# EasyEDA Pro project V2.0.epro, board 正式版
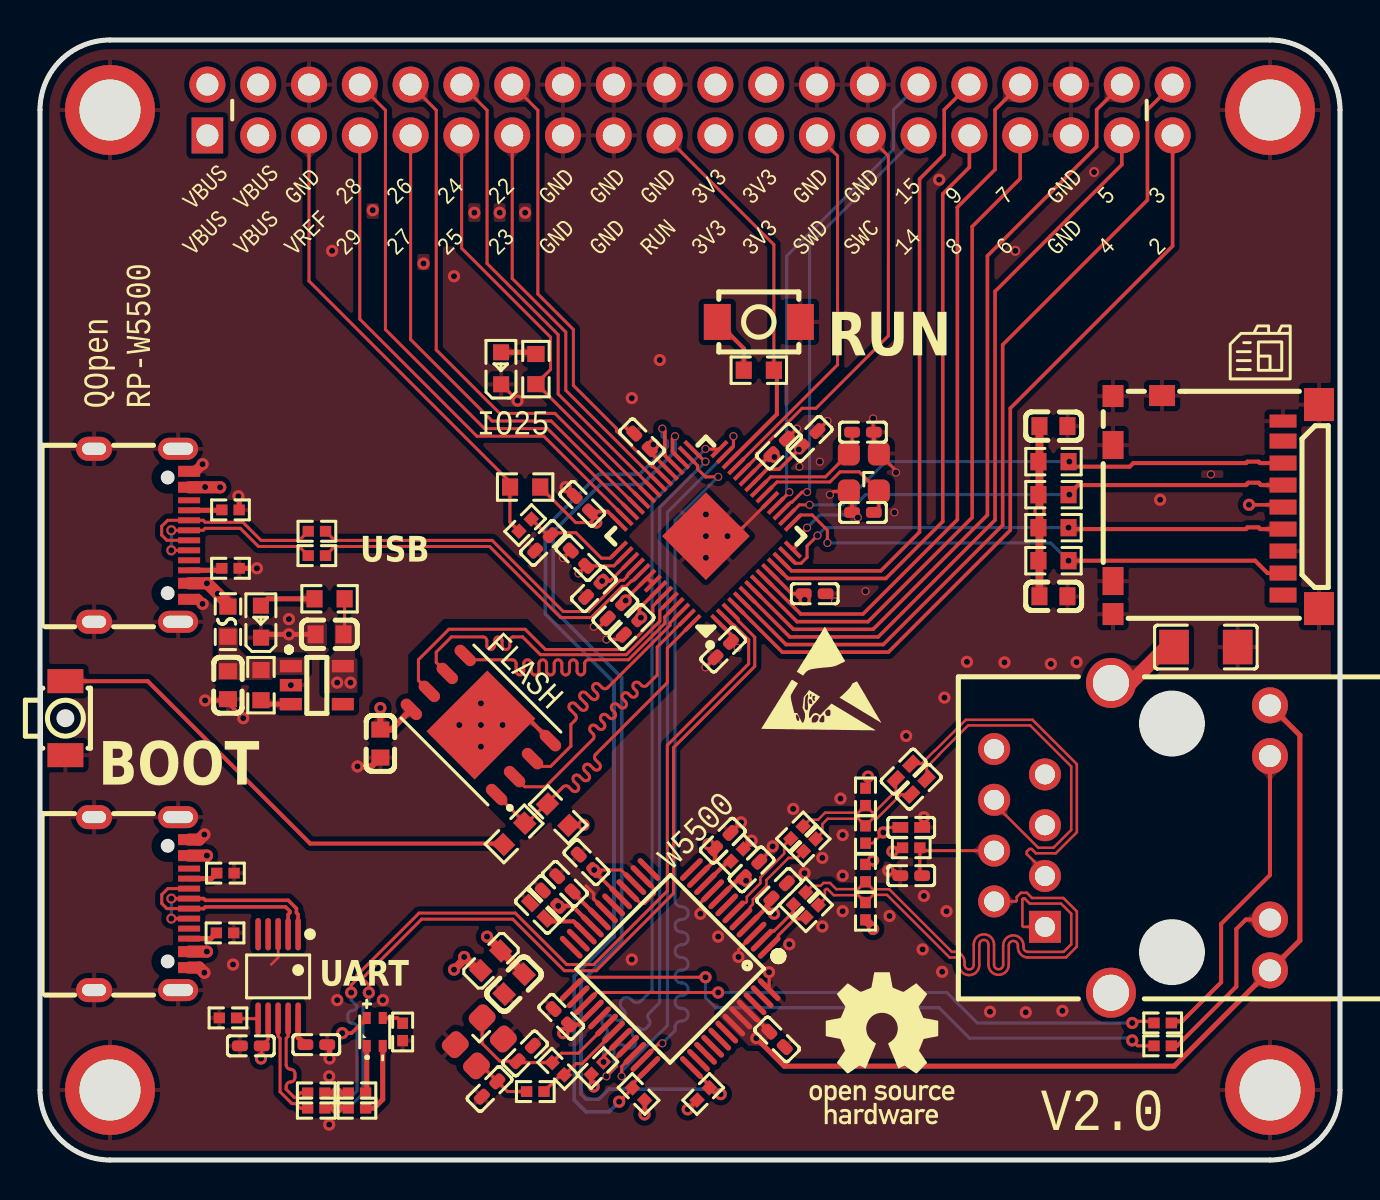
[diagram p1: board, top side]
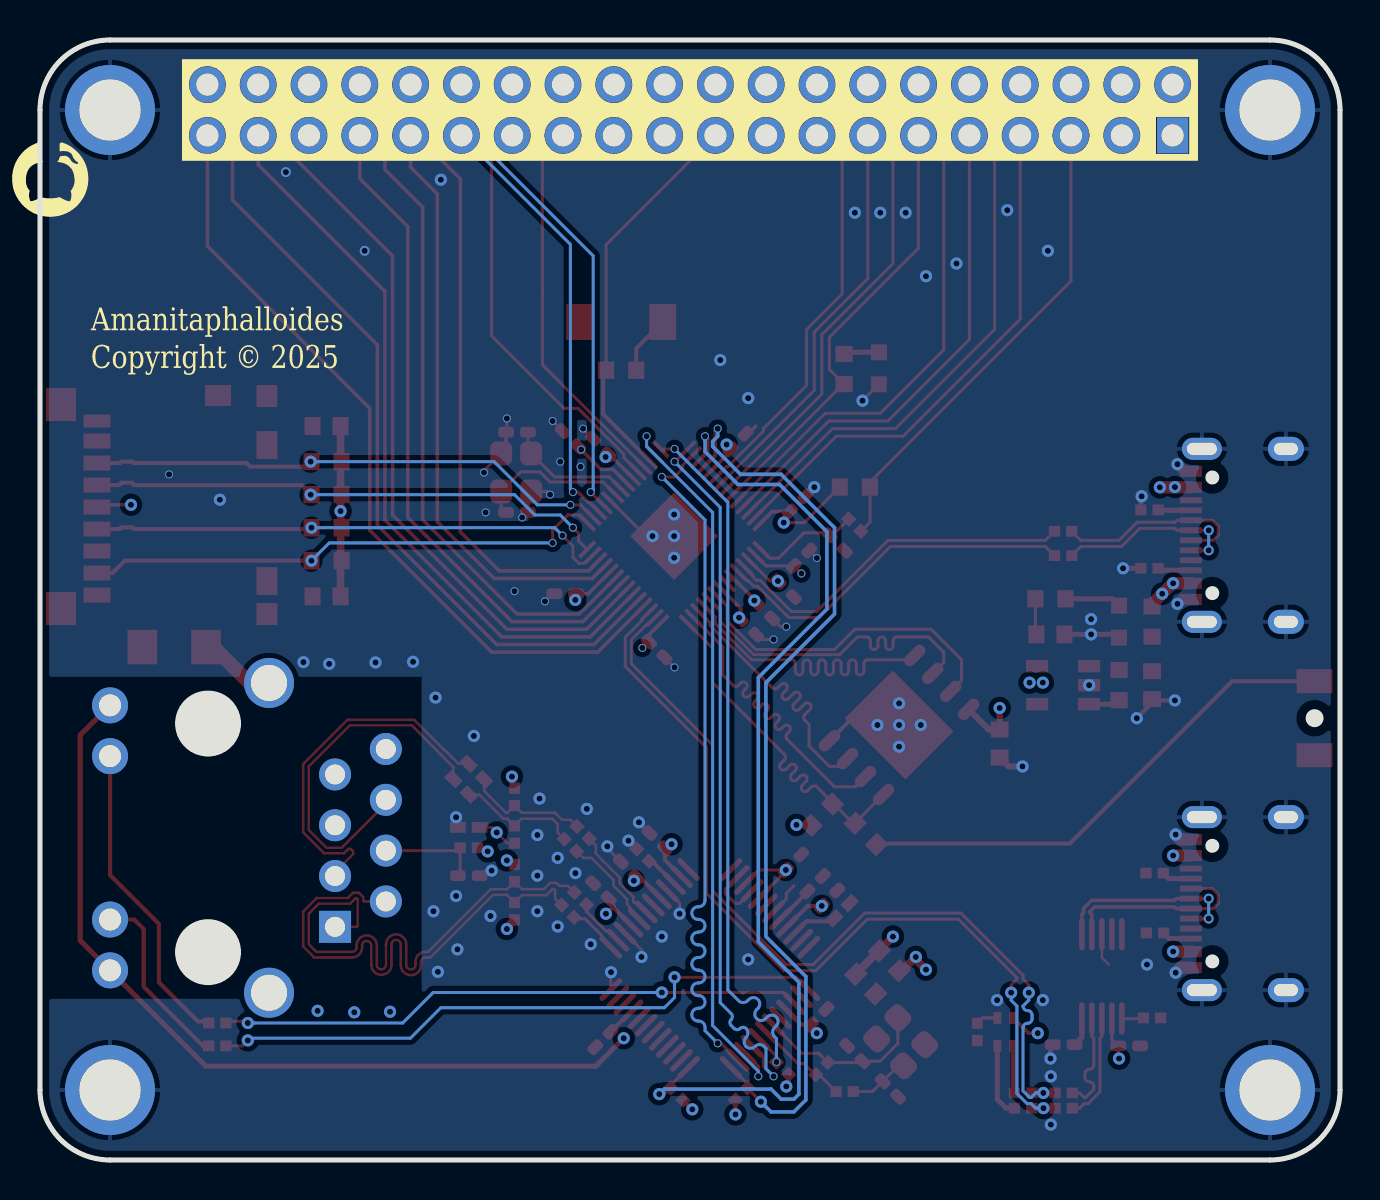
[diagram p2: board, bottom side, seen from below]

Outline 65 x 56 mm; copper layers: Top Layer, Inner1, Inner2, Bottom Layer. Coordinates in mm from the lower left corner of the outline.
Outline path: 0,52.5 0,3.5 arc(1.03,1.03) 3.5,0 61.5,0 arc(63.97,1.03) 65,3.5 65,52.5 arc(63.97,54.97) 61.5,56 3.5,56 arc(1.03,54.97) 0,52.5
Stack: Top Layer 0.035mm 外层铜厚1oz / Dielectric1 0.2104mm 7628 RC49% 8.6mil / Inner1 0.0152mm 内层铜厚 / Dielectric2 1.065mm 1.1mm H/HOZ 含铜 / Inner2 0.0152mm 内层铜厚 / Dielectric3 0.2104mm 7628 RC49% 8.6mil / Bottom Layer 0.035mm 外层铜厚1oz

## Design rules (mm)
net D-: DP12
net D+: DP12
net USB-: DP6
net USB+: DP6
net GPIO0: DP8
net GPIO1: DP8
net $1N8173: DP2
net $1N8174: DP2
net D+2: DP13
net D-2: DP13
net TXP: DP5
net TXN: DP5
net RXP: DP3
net RXN: DP3
net $1N16357: DP9
net $1N16354: DP9
net $1N70953: DP10
net $1N70956: DP10
net $1N70865: DP11
net $1N70868: DP11
template: 自定义配置
spacing copperThickness1oz (default): track to track 0.102, other pairs 0.152 to 0.3
spacing copperThickness2oz: track to track 0.203, other pairs 0.152 to 0.3
track width copperThickness1oz (default): min 0.127, default 0.152, max 2.54
track width copperThickness2oz: min 0.203, default 0.254, max 2.54
differential pair differentialPair (default): width min 0.127, default 0.152, max 2.54; gap min 0.152, default 0.152
via viaSize (default): diameter min 0.4, default 0.61, max 10; hole min 0.3, default 0.305, max 6.299

## Placement (name value [footprint] x y rotation side)
C1  10uF  [C0603]  50.67 36.7 180 top
C2  100nF  [C0603]  50.67 28.19 180 top
C3  1uF  [C0603]  9.4 23.74 90 top
C4  1uF  [C0603]  14.48 26.28 0 top
C5  100nF  [C0402#2]  13.81 5.77 0 top
C6  10nF  [C0402]  43.56 16.63 180 top
C7  6.8nF  [C0402]  43.94 18.66 45 top
C8  6.8nF  [C0402]  43.18 19.42 45 top
C9  100nF  [C0402#2]  10.54 5.71 0 top
C10  22nF  [C0402#2]  43.56 14.22 0 top
C11  4.7uF  [C0402#2]  38.74 28.31 0 top
C12  4.7uF  [C0402#2]  29.58 26.65 225 top
C13  100nF  [C0402#2]  36.85 6.03 135 top
C14  1uF  [C0603]  23.71 8.8 45 top
C15  100nF  [C0402#2]  34.14 15.97 225 top
C16  100nF  [C0402#2]  27.32 14.89 315 top
C17  100nF  [C0402#2]  36.96 13.45 225 top
C18  100nF  [C0402#2]  35.58 14.53 225 top
C19  100nF  [C0402#2]  25.53 13.09 315 top
C20  100nF  [C0402#2]  26.92 30.09 135 top
C21  100nF  [C0402#2]  34.16 25.52 225 top
C22  100nF  [C0402#2]  30.1 35.93 135 top
C23  100nF  [C0402#2]  27.12 32.81 135 top
C24  100nF  [C0402#2]  28.77 27.46 225 top
C25  100nF  [C0402#2]  38.48 36.06 45 top
C26  1nF  [C1206]  58.29 25.65 180 top
C27  100nF  [C0402#2]  27.69 28.54 225 top
C28  100nF  [C0402#2]  36.96 35.68 45 top
C29  4.7uF  [C0402#2]  25.15 30.85 45 top
C30  100nF  [C0402#2]  26.06 7.16 135 top
C31  12pF  [C0402#2]  41.15 32.38 0 top
C32  12pF  [C0402#2]  41.15 36.39 180 top
C33  10pF  [C0402#2]  22.48 3.55 45 top
C34  4.7uF  [C0402#2]  26.24 13.81 315 top
C35  10pF  [C0402#2]  24.26 5.33 225 top
C36  10nF  [C0402]  24.9 12.46 315 top
C37  100nF  [C0603]  17.02 20.82 270 top
CARD1  TF-020  [TF-SMD_TF-020]  58.8 32.76 90 top
F1  BSMD0603-050-6V  [F0603]  9.4 26.92 270 top
H1  B-2100S40P-B110  [HDR-TH_40P-P2.54-V-M-R2-C20-S2.54]  32.5 52.5 0 top
J1  HR911105A  [RJ45-TH_HR911105A]  54.6 16.11 90 top
L1  BLM18PG121SN1D  [L0603]  22.54 9.96 225 top
LED1  NCD0603R1  [LED0603-RD_RED]  11.05 26.92 90 top
LED2  NH-B1515RGBA-HF  [LED-ARRAY-SMD_4P-L1.6-W1.5-TL_NH-B1515RGBA]  16.74 6.4 90 top
LED3  NCD0603R1  [LED0603-RD_RED]  23.05 39.59 90 top
NOREF  -  [Pad_e558]  3.5 52.5 0 top
NOREF#2  -  [Pad_e559]  61.5 52.5 0 top
NOREF#3  -  [Pad_e560]  61.5 3.5 0 top
NOREF#4  -  [Pad_e553]  3.5 3.5 0 top
R1  27Ω  [R0402]  13.84 31.44 0 top
R2  27Ω  [R0402]  13.84 30.22 0 top
R3  5.1kΩ  [R0402]  9.53 32.5 180 top
R4  470Ω  [R0603]  14.48 28.06 0 top
R5  10kΩ  [R0603]  50.67 34.92 0 top
R6  10kΩ  [R0603]  50.67 33.27 0 top
R7  10kΩ  [R0603]  50.67 31.62 0 top
R8  5.1kΩ  [R0402]  9.53 29.58 180 top
R9  100kΩ  [R0603]  11.05 23.74 90 top
R10  10kΩ  [R0603]  50.67 29.97 0 top
R11  1kΩ  [R0402]  18.13 6.4 270 top
R12  5.1kΩ  [R0402]  9.27 14.34 180 top
R13  100Ω  [R0402]  15.85 3.35 0 top
R14  100Ω  [R0402]  15.85 2.59 0 top
R15  22Ω  [R0402]  13.81 3.35 0 top
R16  22Ω  [R0402]  13.81 2.59 0 top
R17  5.1kΩ  [R0402]  9.25 11.36 180 top
R18  4.7kΩ  [R0402]  9.4 7.1 0 top
R19  10Ω  [R0402]  43.56 15.61 0 top
R20  200Ω  [R0603]  24.26 33.65 0 top
R21  100Ω  [R0402]  56.13 5.71 0 top
R22  100Ω  [R0402]  56.13 6.85 0 top
R23  1Ω  [R0402]  24.26 31.74 225 top
R24  4.7kΩ  [R0402]  33.16 3.3 225 top
R25  49.9Ω  [R0402]  41.28 14.34 90 top
R26  49.9Ω  [R0402]  41.28 12.44 270 top
R27  4.7kΩ  [R0402]  29.93 3.3 315 top
R28  4.7kΩ  [R0402]  27.87 4.59 225 top
R29  49.9Ω  [R0402]  41.28 18.15 90 top
R30  49.9Ω  [R0402]  41.28 16.27 270 top
R31  3.3Ω  [R0402]  38.61 12.44 225 top
R32  3.3Ω  [R0402]  37.97 13.07 45 top
R33  3.3Ω  [R0402]  38.48 15.74 225 top
R34  3.3Ω  [R0402]  37.85 16.38 45 top
R35  470Ω  [R0603]  24.8 39.55 90 top
R36  12.4kΩ  [R0402]  34.86 15.25 225 top
R37  1MΩ  [R0402]  25.91 4.56 315 top
R38  0Ω  [R0402]  24.76 3.42 0 top
R39  1kΩ  [R0603]  35.94 39.49 180 top
R40  10kΩ  [R0603]  25.91 17.27 315 top
R41  1kΩ  [R0603]  23.71 16.31 225 top
RUN  TS-1071AD-A1B3-D4  [SW-SMD_L4.0-W3.0-LS4.8]  35.94 41.9 0 top
SW1  TS-1063S-B3D4  [KEY-SMD_L3.0-W2.5-LS4.0_TS-1603S]  1.27 22.09 270 top
U1  AP2112K-3.3TRG1  [SOT-25-5_L2.9-W1.6-P0.95-LS2.8-BL]  13.84 23.74 270 top
U2  CH340E  [MSOP-10_L3.0-W3.0-P0.50-LS5.0-BL]  11.91 9.18 180 top
U3  RP2040  [LQFN-56_L7.0-W7.0-P0.4-EP]  33.29 31.19 135 top
U4  W5500  [LQFP-48_L7.0-W7.0-P0.50-LS9.0-BL]  31.51 9.58 135 top
U5  W25Q16  [WSON-8_L6.0-W5.0-P1.27-BL-EP]  22.05 21.75 45 top
USB1  TYPE-C 16PIN 2MD(073)  [USB-C-SMD_TYPE-C-6PIN-2MD-073]  5.08 31.23 270 top
USB2  TYPE-C 16PIN 2MD(073)  [USB-C-SMD_TYPE-C-6PIN-2MD-073]  5.08 12.82 270 top
X1  12MHz  [osc-smd_4p-l2.5-w2.0-bl]  41.19 34.38 90 top
X2  25MHz  [CRYSTAL-SMD_4P-L2.5-W2.0-BL]  21.97 5.91 225 top

## Footprints (pads in the part's own frame, mm; a bottom-side part is the same pattern mirrored in y, then rotated)
C0402
  rect 0.79x0.54 smd: 1(-0.545,0) 2(0.545,0)
C0402#2
  rrect 0.79x0.54 smd: 1(-0.545,0) 2(0.545,0)
C0603
  rect 0.8x0.9 smd: 1(-0.7,0) 2(0.7,0)
C1206
  rect 1.485x1.728 smd: 1(-1.593,0) 2(1.593,0)
CRYSTAL-SMD_4P-L2.5-W2.0-BL
  rrect 1.2x1.1 smd: 1(-0.95,-0.75) 2(0.95,-0.75) 3(0.95,0.75) 4(-0.95,0.75)
F0603
  rect 0.806x0.864 smd: 1(-0.753,0) 2(0.753,0)
HDR-TH_40P-P2.54-V-M-R2-C20-S2.54
  rect 1.575x1.8 hole 1.1: 1(-24.13,-1.27)
  round 1.8 hole 1.1: 2(-24.13,1.27) 3(-21.59,-1.27) 4(-21.59,1.27) 5(-19.05,-1.27) 6(-19.05,1.27) 7(-16.51,-1.27) 8(-16.51,1.27) 9(-13.97,-1.27) 10(-13.97,1.27) 11(-11.43,-1.27) 12(-11.43,1.27) 13(-8.89,-1.27) 14(-8.89,1.27) 15(-6.35,-1.27) 16(-6.35,1.27) 17(-3.81,-1.27) 18(-3.81,1.27) 19(-1.27,-1.27) 20(-1.27,1.27) 21(1.27,-1.27) 22(1.27,1.27) 23(3.81,-1.27) 24(3.81,1.27) 25(6.35,-1.27) 26(6.35,1.27) 27(8.89,-1.27) 28(8.89,1.27) 29(11.43,-1.27) 30(11.43,1.27) 31(13.97,-1.27) 32(13.97,1.27) 33(16.51,-1.27) 34(16.51,1.27) 35(19.05,-1.27) 36(19.05,1.27) 37(21.59,-1.27) 38(21.59,1.27) 39(24.13,-1.27) 40(24.13,1.27)
KEY-SMD_L3.0-W2.5-LS4.0_TS-1603S
  rect 1.2x1.8 smd: 1(-1.85,0) 2(1.85,0)
L0603
  rect 0.8x0.864 smd: 1(-0.7,0) 2(0.7,0)
LED0603-RD_RED
  rect 0.8x0.8 smd: 1(-0.799,-0.004) 2(0.799,0.004)
LED-ARRAY-SMD_4P-L1.6-W1.5-TL_NH-B1515RGBA
  rect 0.6x0.4 smd: 1(-0.7,0.4) 2(0.7,0.4) 3(0.7,-0.4) 4(-0.7,-0.4)
LQFN-56_L7.0-W7.0-P0.4-EP
  rect 1.1x0.2 smd: 1(-3.55,2.6) 2(-3.55,2.2) 3(-3.55,1.8) 4(-3.55,1.4) 5(-3.55,1) 6(-3.55,0.6) 7(-3.55,0.2) 8(-3.55,-0.2) 9(-3.55,-0.6) 10(-3.55,-1) 11(-3.55,-1.4) 12(-3.55,-1.8) 13(-3.55,-2.2) 14(-3.55,-2.6) 29(3.55,-2.6) 30(3.55,-2.2) 31(3.55,-1.8) 32(3.55,-1.4) 33(3.55,-1) 34(3.55,-0.6) 35(3.55,-0.2) 36(3.55,0.2) 37(3.55,0.6) 38(3.55,1) 39(3.55,1.4) 40(3.55,1.8) 41(3.55,2.2) 42(3.55,2.6)
  rect 0.2x1.1 smd: 15(-2.6,-3.55) 16(-2.2,-3.55) 17(-1.8,-3.55) 18(-1.4,-3.55) 19(-1,-3.55) 20(-0.6,-3.55) 21(-0.2,-3.55) 22(0.2,-3.55) 23(0.6,-3.55) 24(1,-3.55) 25(1.4,-3.55) 26(1.8,-3.55) 27(2.2,-3.55) 28(2.6,-3.55) 43(2.6,3.55) 44(2.2,3.55) 45(1.8,3.55) 46(1.4,3.55) 47(1,3.55) 48(0.6,3.55) 49(0.2,3.55) 50(-0.2,3.55) 51(-0.6,3.55) 52(-1,3.55) 53(-1.4,3.55) 54(-1.8,3.55) 55(-2.2,3.55) 56(-2.6,3.55)
  rect 3.1x3.1 smd: 57(0,0)
LQFP-48_L7.0-W7.0-P0.50-LS9.0-BL
  oval 0.27x1.5 smd: 1(-2.75,-4.25) 2(-2.25,-4.25) 3(-1.75,-4.25) 4(-1.25,-4.25) 5(-0.75,-4.25) 6(-0.25,-4.25) 7(0.25,-4.25) 8(0.75,-4.25) 9(1.25,-4.25) 10(1.75,-4.25) 11(2.25,-4.25) 12(2.75,-4.25) 25(2.75,4.25) 26(2.25,4.25) 27(1.75,4.25) 28(1.25,4.25) 29(0.75,4.25) 30(0.25,4.25) 31(-0.25,4.25) 32(-0.75,4.25) 33(-1.25,4.25) 34(-1.75,4.25) 35(-2.25,4.25) 36(-2.75,4.25)
  oval 1.5x0.27 smd: 13(4.25,-2.75) 14(4.25,-2.25) 15(4.25,-1.75) 16(4.25,-1.25) 17(4.25,-0.75) 18(4.25,-0.25) 19(4.25,0.25) 20(4.25,0.75) 21(4.25,1.25) 22(4.25,1.75) 23(4.25,2.25) 24(4.25,2.75) 37(-4.25,2.75) 38(-4.25,2.25) 39(-4.25,1.75) 40(-4.25,1.25) 41(-4.25,0.75) 42(-4.25,0.25) 43(-4.25,-0.25) 44(-4.25,-0.75) 45(-4.25,-1.25) 46(-4.25,-1.75) 47(-4.25,-2.25) 48(-4.25,-2.75)
MSOP-10_L3.0-W3.0-P0.50-LS5.0-BL
  oval 0.28x1.62 smd: 1(-1,-2.11) 2(-0.5,-2.11) 3(0,-2.11) 4(0.5,-2.11) 5(1,-2.11) 6(1,2.11) 7(0.5,2.11) 8(0,2.11) 9(-0.5,2.11) 10(-1,2.11)
osc-smd_4p-l2.5-w2.0-bl
  rrect 1.2x1.1 smd: 1(-0.95,-0.75) 2(0.95,-0.75) 3(0.95,0.75) 4(-0.95,0.75)
Pad_e553
  round 4.5 hole 3.05: 1(0,0)
Pad_e558
  round 4.5 hole 3.05: 1(0,0)
Pad_e559
  round 4.5 hole 3.05: 2(0,0)
Pad_e560
  round 4.5 hole 3.05: 3(0,0)
R0402
  rect 0.566x0.54 smd: 1(-0.433,0) 2(0.433,0)
R0603
  rect 0.806x0.864 smd: 1(-0.753,0) 2(0.753,0)
RJ45-TH_HR911105A
  rect 1.6x1.6 hole 1: 1(-4.45,4.355)
  round 1.6 hole 1: 2(-3.18,6.895) 3(-1.91,4.355) 4(-0.64,6.895) 5(0.63,4.355) 6(1.9,6.895) 7(3.17,4.355) 8(4.44,6.895)
  round 1.8 hole 1.1: 9(-6.625,-6.895) 10(-4.085,-6.895) 11(4.085,-6.895) 12(6.625,-6.895)
  round 2.5 hole 1.8: SH1(-7.745,1.055) SH2(7.745,1.055)
SOT-25-5_L2.9-W1.6-P0.95-LS2.8-BL
  rect 0.623x1.105 smd: 1(-0.95,-1.3) 2(-0.001,-1.3) 3(0.95,-1.3) 4(0.95,1.3) 5(-0.95,1.3)
SW-SMD_L4.0-W3.0-LS4.8
  rect 1.35x1.8 smd: 1(-2.075,0) 2(2.075,0)
TF-SMD_TF-020
  rect 0.75x1.35 smd: 1(3.188,-3.35) 2(2.087,-3.35) 3(0.988,-3.35) 4(-0.113,-3.35) 5(-1.212,-3.35) 6(-2.312,-3.35) 7(-3.413,-3.35) 8(-4.513,-3.35)
  rect 0.65x1.35 smd: 9(4.188,-3.35)
  rect 1.1x1.05 smd: 10(-5.463,5.15) 10(5.438,5.15)
  rect 1.65x1.5 smd: 10(-5.188,-5.15) 10(5.013,-5.15)
  rect 1.4x1.05 smd: 10(-3.812,5.15) 10(2.988,5.15)
  rect 1.05x1.3 smd: 10(5.463,2.7)
USB-C-SMD_TYPE-C-6PIN-2MD-073
  rect 0.55x1.1 smd: 1(-3.2,2.375) 2(-2.4,2.375) 11(2.4,2.375) 12(3.2,2.375)
  rect 0.3x1.1 smd: 3(-1.75,2.375) 4(-1.25,2.375) 5(-0.75,2.375) 6(-0.25,2.375) 7(0.25,2.375) 8(0.75,2.375) 9(1.25,2.375) 10(1.75,2.375)
  oval 1.1x2 hole 0.6x1.5: 13(-4.325,1.825) 14(4.325,1.825)
  oval 1.2x1.8 hole 0.6x1.2: 13(-4.325,-2.375) 14(4.325,-2.375)
WSON-8_L6.0-W5.0-P1.27-BL-EP
  oval 0.581x1.276 smd: 1(-1.905,-3.013) 2(-0.635,-3.013) 3(0.635,-3.013) 4(1.905,-3.013) 5(1.905,3.013) 6(0.635,3.013) 7(-0.635,3.013) 8(-1.905,3.013)
  rect 4.3x3.4 smd: 9(0,0)

## Nets
As in the schematic, except:
GND: C1.1 C2.1 C3.1 C4.1 C5.2 C6.1 C9.1 C10.1 C11.2 C12.2 C13.1 C14.1 C15.1 C16.1 C17.1 C18.1 C19.1 C20.2 C21.2 C22.2 C23.2 C24.2 C25.2 C26.1 C27.2 C28.2 C29.1 C30.2 C31.1 C32.1 C33.1 C34.1 C35.1 C36.1 C37.2 CARD1.6 CARD1.9 CARD1.10 H1.6 H1.15 H1.16 H1.17 H1.18 H1.20 H1.26 H1.28 H1.35 H1.36 J1.8 LED1.1 LED3.1 NOREF.1 NOREF#2.2 NOREF#3.3 NOREF#4.1 R3.1 R8.1 R11.2 R12.1 R17.1 R18.1 R36.1 RUN.2 SW1.2 U1.2 U2.3 U3.19 U3.57 U4.3 U4.9 U4.14 U4.16 U4.19 U4.29 U4.48 U5.4 U5.9 USB1.1 USB1.12 USB1.13 USB1.14 USB2.1 USB2.12 USB2.13 USB2.14 X1.2 X1.4 X2.2 X2.4

Pads without a net: CARD1 1 8; J1 7; U1 4; U2 4 5; U4 7 12 13 18 23 24 26 38 39 40 41 42 46 47; USB1 3 9; USB2 3 9

## Via types
v1: diameter 0.61, hole 0.305, Top Layer to Bottom Layer, 126 vias
v2: diameter 0.405, hole 0.305, Top Layer to Bottom Layer, 35 vias
v3: diameter 0.5, hole 0.305, Top Layer to Bottom Layer, 4 vias
v4: diameter 0.51, hole 0.305, Top Layer to Bottom Layer, 2 vias

## Routing (per net, layer and track width the routed paths; a pad name or vN(x,y) marks a point on that pad's centre or on a via; arc(x,y) is an arc through that point)
1V1: length 5.4
  Top Layer w0.152: U3.45 28.5,28.95 v1(28.1,28.95) C27.1
  Top Layer w0.178: U3.23 36.55,35.29 C28.1 ; U3.50 29.96,27.58 C12.1
  vias: v1(30.05,27.12) v1(36.72,35.15)
3V3: length 98.9
  Top Layer w0.152: R40.2 27.15,16.73 v1(27.18,16.76) ; U3.44 28.7,29.71 C20.1 v2(26.93,29.33) ; v1(11.05,5.07) 11.09,5.11 C9.2 11.41,6.03 U2.7 ; R20.2 26.79,31.87 v1(27.81,31.87) ; R4.2 15.23,26.34 C4.2
  Top Layer w0.178: v1(15.11,6.34) 15.58,6.34 LED2.2 ; v1(27.81,31.87) 27.81,32.11 27.5,32.42 28.39,32.42 U3.42 ; 30.64,28.83 U3.48 29.28,28.03 v1(29.28,27.97) ; v2(34.88,25.61) 34.58,25.91 C21.1 34.55,26.26 U3.1 ; 36.51,29.39 37.59,28.31 C11.1 ; v1(60.45,32.76) 62.04,32.76 62.15,32.65 ; U3.33 30.48,35.42 C22.1 ; U3.22 36.35,34.54 36.96,34.54 v2(37.94,35.52) C25.1
  Top Layer w0.203: U4.28 26.94,6.78 C30.1 ; C13.2 35.43,7.46 U4.45 ; R28.2 27.57,3.8 v1(27.69,3.68) ; R27.2 30.23,2.29 v1(30.23,2.28) ; v1(32.38,2.53) 32.39,2.53 R24.2
  Top Layer w0.254: v1(35.81,6.09) 37.21,4.69 56.71,4.69 J1.9 62.99,10.98 62.99,21.24 J1.12
  Top Layer w0.305: v1(17.02,22.6) C37.1 17.56,21.52 18.57,22.53
  Top Layer w0.381: C1.2 v1(49.97,32.45) C2.2
  Top Layer w0.406: v1(20.7,9.52) 21.21,10.03 v1(21.21,10.15) 21.9,9.47 L1.2
  Inner2 w0.178: v1(49.97,32.45) 60.14,32.45 v1(60.45,32.76)
  vias: v1(14.86,23.87) v1(15.52,23.87) v1(26.16,6.34) v1(30.67,35.77) v1(38.24,28)
3V3A: length 17.1
  Top Layer w0.127: R19.1 42.8,15.61 v1(42.62,15.43)
  Top Layer w0.152: U4.15 29.06,14.5 v1(27.71,14.5) ; v1(41.66,14.98) 41.45,14.78 R25.2
  Top Layer w0.178: v1(27.71,14.5) 27.71,14.44 29.03,13.11
  Top Layer w0.203: U4.11 33.76,15 C15.2 33.63,15.58 v1(33.42,15.79) ; C17.2 36.57,12.95 36.32,12.7 ; U4.4 36.32,12.62 36.32,12.7 ; U4.21 26.61,12.7 v1(25.91,12.7) ; 36.32,12.7 v1(36.7,12.31) ; U4.8 35.02,14.14 C18.2 35.31,14.03 v1(35.31,13.96)
  Top Layer w0.406: C14.2 24.2,9.32 v1(22.35,11.17) ; v1(41.66,11.55) 41.66,11.62 R26.2
GND: length 50
  Top Layer w0.127: C10.1 42.76,14.47 v1(42.42,14.47) ; C6.1 44.2,16.72 v1(44.2,17.14) ; 11.56,9.77 11.91,10.12 U2.3
  Top Layer w0.152: v2(42.8,34.38) 42.8,34.47 X1.2 ; v1(34.93,10.15) 34.93,10.52 U4.3 ; v2(27.69,26.66) 27.97,26.66 C24.2 ; R36.1 v1(35.58,15.97) ; v1(35.05,16.88) 35.05,16.88 C15.1 ; v2(39.5,33.27) 39.66,33.43 X1.4 ; U3.19 34.71,31.19 v1(34.38,31.19) v1(33.29,31.19) ; LED3.1 23.88,37.97 v1(23.88,37.97) ; v1(36.45,9.39) 36.46,9.38 U4.48 ; v1(36.63,15.68) 36.63,15.59 35.96,14.92 ; C20.2 v2(26.16,30.1) ; 27.31,13.71 27.69,13.33 27.69,13.05 U4.19 ; C32.1 41.66,36.43 v2(41.66,37.08) ; 33.63,13.47 33.02,12.85 v1(33.02,12.31) ; v2(28.32,26.03) 28.96,26.03 C12.2 ; C25.2 v2(39.37,36.95) ; U4.16 30.02,12.83 30.24,12.83 30.73,13.32 30.73,13.54 U4.14 ; v2(33.27,24.63) C21.2 ; C28.2 v2(37.85,36.57)
  Top Layer w0.178: C22.2 29.59,36.32 29.21,36.7 ; v1(26.28,33.64) C23.2
  Top Layer w0.203: v1(10.16,22.09) 9.4,22.85 C3.1 9.34,22.98 v1(8.25,22.98) ; v1(22.05,21.75) 22.64,22.34 24.15,22.34 U5.4 ; X1.2 41.69,35.58 C32.1 ; X1.4 40.6,33.27 C31.1 40.64,32.38 v2(40.89,32.12)
  Top Layer w0.254: v1(9.92,33.19) 9.96,33.15 R3.1 ; v1(14.48,5.07) 14.48,5.65 C5.2 ; R8.1 v1(10.85,29.58) ; C4.1 v1(12.45,26.28) 11.22,26.28 LED1.1
  Top Layer w0.305: v1(15.88,19.68) 16.57,19.68 C37.2
  Top Layer w0.508: v1(8.13,34.79) 7.77,34.44 USB1.1 ; USB1.12 7.9,28.03 v1(8.13,27.81)
  Top Layer w0.61: USB2.12 7.96,9.62 v1(8.22,9.37) ; v1(8.22,16.27) 7.96,16.02 USB2.1
  Inner1 w0.127: 45.09,19.3 46.46,19.3 J1.8
  vias: v1(9.65,9.77) v1(12.45,27.04) v1(12.54,23.74) v1(14.46,4.18) v1(14.46,1.77) v1(14.6,45.46) v1(14.86,7.99) v1(16.64,47.49) v1(17.15,7.99) v1(19.18,44.82) v1(20.7,44.19) v1(20.96,21.75) v1(21.72,47.36) v1(22.05,22.83) v1(22.05,20.67) v1(22.99,47.36) v1(23.13,21.75) v1(24.26,47.36) v1(29.59,38.09) v1(29.59,10.03) v1(30.99,40) v1(33.29,32.28) v1(33.29,30.11) v1(33.91,11.17) v1(37.47,10.79) v1(37.66,17.55) v1(38.23,14.34) v1(39.12,15.11) v1(39.12,11.68) v1(40.03,18.07) v1(40.13,16.25) v1(40.13,14.22) v1(40.13,12.44) v1(42.48,12.2) v1(43.31,21.2) v1(44.13,10.53) v1(44.2,13.2) v1(44.96,49.02) v1(45.11,9.41) v1(45.22,23.12) v1(45.33,12.44) v1(46.35,24.91) v1(47.5,7.41) v1(48.22,24.88) v1(49.29,7.38) v1(50.54,24.8) v1(51.12,7.46) v1(51.83,24.89) v1(56.01,33.01) v2(37.97,34.66) v2(38.99,34.92) v2(39.75,27.93) v2(41.28,28.44) v2(42.72,32.38) v2(58.55,34.28) v3(48.77,45.46) v3(52.71,49.4)
VBUS: length 55.9
  Top Layer w0.61: 8.37,28.83 v1(8.89,28.31) 9.4,27.81 F1.1 ; 8.37,28.83 v1(8.34,28.83) ; 8.37,28.83 v1(8.34,28.83) ; USB1.11 v1(8.34,28.83) ; USB1.2 v1(9.01,33.64) ; USB2.11 v1(8.34,10.42) ; USB2.2 v1(8.34,15.22)
  Inner2 w0.61: H1.1 9.01,50.59 v1(9.01,33.64) 8.27,33.64 v1(8.25,33.65) 8.25,28.92 v1(8.34,28.83) 9.02,28.16 9.02,15.89 v1(8.34,15.22) v1(8.34,10.42) ; H1.1 H1.2 ; H1.1 H1.3 H1.4
ACT: length 29.3
  Top Layer w0.152: 55.68,6.93 54.69,6.93 v1(54.61,6.85) ; v1(33.91,8.38) 27.83,8.38 27.27,7.81
  Bottom Layer w0.152: v1(54.61,6.85) 46.86,6.85 45.34,8.38 v1(33.91,8.38)
ADC_VREF: length 24.2
  Top Layer w0.152: 23.5,33.64 R20.1 ; 23.5,33.64 23.5,33.9 13.45,43.95 H1.5 ; 23.5,33.64 23.5,31.89 23.95,31.44
D+: length 9.3
  Top Layer w0.152: R2.1 12.95,30.68 10.92,30.68 10.02,31.58 8.25,31.58 8.16,31.48 USB1.6 v4(6.57,31.48) ; USB1.8 v4(6.57,30.48)
  Bottom Layer w0.152: v4(6.57,30.48) v4(6.57,31.48)
D+2: length 9.7
  Top Layer w0.178: v3(6.57,13.07) USB2.6 8.18,13.07 8.27,12.98 12.41,12.98 12.82,12.58 12.82,12.36 12.91,12.28 U2.1 ; USB2.8 v3(6.57,12.07)
  Bottom Layer w0.152: v3(6.57,12.07) v3(6.57,13.07)
D-: length 10
  Top Layer w0.152: USB1.7 6.35,30.98 6.08,31.25 6.08,31.69 6.38,31.98 USB1.5 8.16,31.98 8.25,31.89 10.14,31.89 11.05,30.98 12.96,30.98 R1.1
D-2: length 9.8
  Top Layer w0.152: USB2.7 6.35,12.57 6.09,12.83 6.09,13.27 6.39,13.57 USB2.5
  Top Layer w0.178: U2.2 12.41,12.28 12.49,12.36 12.49,12.44 12.28,12.66 8.27,12.66 8.18,12.57 USB2.7
GPIO0: length 44.2
  Top Layer w0.152: 34.25,27.13 34.63,26.75 34.7,26.75 35.43,26.01 35.43,24.81 31.37,20.74 31.37,13.45 27.69,9.77 26.34,9.77 23.76,12.35 18.95,12.35 15.85,9.24 15.85,9.04 15.56,8.75 v1(15.56,8.37)
  Top Layer w0.254: R13.1 v1(14.83,3.35) R15.2
  Bottom Layer w0.152: v1(15.56,8.37) 15.56,7.99 15.85,7.7 arc(15.78,7.54) 15.62,7.47 arc(15.46,7.4) 15.4,7.24 15.4,7.06 arc(15.46,6.9) 15.62,6.84 arc(15.78,6.77) 15.85,6.61 15.85,3.46 15.52,3.13 15.44,3.13 15.22,3.35 v1(14.83,3.35)
GPIO1: length 44.5
  Top Layer w0.152: v1(16.44,8.37) 16.44,8.75 16.15,9.04 16.15,9.12 19.08,12.04 23.64,12.04 26.21,9.47 27.81,9.47 31.67,13.33 31.67,20.62 35.74,24.68 35.74,26.14 34.91,26.96 34.91,27.03 34.53,27.41
  Top Layer w0.254: R16.2 v1(14.83,2.59) R14.1
  Bottom Layer w0.152: v1(16.44,8.37) 16.44,7.99 16.15,7.7 16.15,3.33 15.65,2.82 15.44,2.82 15.22,2.59 v1(14.83,2.59)
GPIO2: length 40.3
  Top Layer w0.178: H1.39 56.63,45.7 48.51,37.58 48.51,31.49 42.42,25.39 37.12,25.39 34.81,27.69
GPIO3: length 42
  Top Layer w0.178: H1.40 55.37,52.51 55.37,48 48.13,40.76 48.13,31.74 42.16,25.77 37.3,25.77 U3.5
GPIO4: length 37.5
  Top Layer w0.178: U3.6 37.49,26.16 41.91,26.16 47.75,32 47.75,43.43 54.09,49.77 H1.37
GPIO5: length 39.2
  Top Layer w0.178: H1.38 52.83,52.51 52.83,50.67 47.37,45.2 47.37,32.25 41.66,26.54 37.67,26.54 U3.7
GPIO6: length 33.7
  Top Layer w0.178: H1.33 49.01,49.07 46.61,46.67 46.61,32.12 41.4,26.92 37.85,26.92 U3.8
GPIO7: length 35.4
  Top Layer w0.178: H1.34 47.75,52.51 47.75,49.52 45.87,47.64 45.87,32.02 41.15,27.3 38.04,27.3 U3.9
GPIO8: length 29.6
  Top Layer w0.178: 36.79,29.67 37.39,29.08 42.29,29.08 45.14,31.92 45.14,48.3 46.47,49.64 H1.31
GPIO9: length 31.3
  Top Layer w0.178: U3.12 37.58,29.46 42.04,29.46 43.98,31.4 43.98,49.05 45.21,50.28 45.21,52.51 H1.32
GPIO10: length 26.2
  Top Layer w0.152: v2(38.88,31.22) 38.35,30.7 38.35,30.13 38.06,29.83 37.77,29.83 U3.13
  Top Layer w0.203: v1(51.43,31.62) 51.5,31.55 60.29,31.55 arc(60.32,31.56) 60.34,31.59 arc(60.35,31.62) 60.38,31.63 60.93,31.63 arc(60.96,31.62) 60.97,31.59 arc(60.98,31.56) 61.01,31.55 62.15,31.55
  Bottom Layer w0.152: v2(38.88,31.22) 39.27,31.62 v1(51.43,31.62)
GPIO11: length 26.2
  Top Layer w0.152: v2(38.35,31.62) 38.08,31.34 38.08,30.95 U3.14
  Top Layer w0.203: 62.15,33.75 61.05,33.75 arc(61.01,33.76) 60.99,33.81 arc(60.97,33.85) 60.93,33.86 60.41,33.86 arc(60.37,33.85) 60.35,33.81 arc(60.34,33.76) 60.3,33.75 51.91,33.75 R6.2
  Bottom Layer w0.152: v2(38.35,31.62) 38.99,32.25 40.26,32.25 41.28,33.27 v1(51.47,33.27)
GPIO12: length 26.2
  Top Layer w0.152: U3.15 38.03,32.25 38.61,32.25 39.37,31.49 v2(39.37,30.85)
  Top Layer w0.203: 62.15,29.35 61.37,29.35 60.76,29.97 v1(51.43,29.97)
  Bottom Layer w0.152: v2(39.37,30.85) 50.54,30.85 v1(51.43,29.97)
GPIO13: length 26.2
  Top Layer w0.152: U3.16 37.97,32.76 v2(38.48,32.76)
  Top Layer w0.203: 62.15,34.85 61.01,34.85 arc(60.98,34.86) 60.97,34.88 arc(60.96,34.91) 60.94,34.92 60.37,34.92 arc(60.35,34.91) 60.34,34.88 arc(60.33,34.86) 60.3,34.85 54.67,34.85 54.48,34.66 51.68,34.66 R5.2
  Bottom Layer w0.152: v1(51.47,34.92) 42.29,34.92 40.13,32.76 v2(38.48,32.76)
GPIO14: length 21.8
  Top Layer w0.152: v2(38.35,33.39) 38.1,33.39 37.59,32.89 37.53,32.89 U3.17
  Bottom Layer w0.152: v2(38.35,33.39) 38.48,33.52 38.48,45.78 H1.29
GPIO15: length 24.1
  Top Layer w0.152: 36.79,32.71 37.47,33.38 v2(37.47,33.39)
  Bottom Layer w0.152: v2(37.47,33.39) 37.34,33.52 37.34,45.2 42.67,50.54 42.67,52.51 H1.30
GPIO16: length 36.8
  Top Layer w0.152: 34.25,35.26 34.67,35.68 v2(34.67,36.19) ; v2(29.08,4.18) 29.08,4.67 U4.34
  Bottom Layer w0.152: v2(29.08,4.18) 29.08,4.44 31.37,6.72 31.37,32.38 34.67,35.68 v2(34.67,36.19)
GPIO17: length 36.8
  Top Layer w0.152: 29.03,6.04 28.18,5.18 v2(28.18,4.9) ; 33.97,35.54 33.28,35.54 v2(33.27,35.55)
  Bottom Layer w0.152: v2(28.18,4.9) 28.18,6.07 28.27,6.17 arc(28.37,6.39) 28.27,6.62 28.19,6.7 arc(28.19,7.15) 28.64,7.15 28.72,7.07 arc(29.17,7.07) 29.17,7.51 29.1,7.58 arc(29.1,8.03) 29.55,8.03 29.62,7.96 arc(29.84,7.87) 30.07,7.96 30.61,8.5 30.61,32.89 v2(33.27,35.55)
GPIO18: length 36.8
  Top Layer w0.152: v2(28.32,4.18) 28.83,4.69 28.83,5.13 U4.33 ; v2(33.27,34.92) 33.25,34.92 32.62,35.54
  Bottom Layer w0.152: v2(28.32,4.18) 28.7,4.56 28.7,5.58 28.8,5.68 arc(29.02,5.77) 29.25,5.68 arc(29.47,5.59) 29.7,5.68 ; v2(33.27,34.92) 30.99,32.63 30.99,7.87 30.44,7.32 arc(30.38,7.17) 30.44,7.03 arc(30.5,6.88) 30.44,6.73 30.29,6.58 arc(30.14,6.51) 29.99,6.58 arc(29.85,6.64) 29.7,6.58 ; 29.7,6.58 arc(29.6,6.35) 29.7,6.13 arc(29.79,5.9) 29.7,5.68
GPIO19: length 36.8
  Top Layer w0.152: v2(31.12,5.84) 30.95,5.84 U4.35 ; U3.30 32.88,34.72 32.88,34.55 33.27,34.16 v2(33.91,34.16)
  Bottom Layer w0.152: v2(31.12,5.84) 31.75,6.47 31.75,6.63 arc(31.84,6.86) 32.07,6.95 32.09,6.95 arc(32.41,7.27) 32.09,7.58 32.07,7.58 arc(31.75,7.9) 32.07,8.22 32.09,8.22 arc(32.41,8.54) 32.09,8.85 32.07,8.85 arc(31.75,9.17) 32.07,9.49 32.09,9.49 arc(32.41,9.81) 32.09,10.12 32.07,10.12 arc(31.75,10.44) 32.07,10.76 32.09,10.76 arc(32.41,11.08) 32.09,11.39 32.07,11.39 arc(31.75,11.71) 32.07,12.03 32.09,12.03 arc(32.41,12.35) 32.09,12.66 32.07,12.66 arc(31.84,12.76) 31.75,12.98 31.75,32 v2(33.91,34.16)
GPIO20: length 49.8
  Top Layer w0.152: v1(34.04,3.29) 33.78,3.29 R24.1 33.47,3.73 U4.37
  Top Layer w0.178: v2(31.75,36.19) 31.62,36.06 31.62,35.41 32.06,34.98
  Bottom Layer w0.178: v1(34.04,3.29) 33.78,3.55 28.45,3.55 27.94,3.04 27.31,3.04 27.05,3.29 27.05,8.88 29.08,10.92 29.08,24.12 25.65,27.55 25.65,31.41 28.02,33.78 30.1,33.78 31.75,35.43 v2(31.75,36.19)
GPIO21: length 46.8
  Top Layer w0.152: v1(28.96,2.91) 29.62,3.58 R27.1 29.62,3.8 U4.36
  Top Layer w0.178: v2(31.12,36.57) 31.24,36.44 31.24,35.23 U3.32
  Bottom Layer w0.178: v2(31.12,36.57) 31.12,36.19 31.37,35.93 31.37,35.68 29.97,34.28 27.94,34.28 25.27,31.62 25.27,27.3 28.7,23.87 28.7,11.17 26.71,9.18 26.71,3 27.31,2.41 28.45,2.41 v1(28.96,2.91)
GPIO22: length 22.8
  Top Layer w0.152: U3.34 30.67,34.66 30.61,34.66 28.83,36.44 28.83,36.57 26.67,38.73 26.67,41.52 24.89,43.3 24.89,52.49 H1.14
GPIO23: length 20.4
  Top Layer w0.152: U3.35 26.29,38.48 26.29,41.39 23.61,44.07 H1.13
GPIO24: length 24.2
  Top Layer w0.152: H1.12 22.35,52.49 22.35,44.82 25.91,41.27 25.91,38.3 30.64,33.56
GPIO25: length 22.4
  Top Layer w0.152: H1.11 21.08,51.22 21.08,45.59 25.53,41.14 25.53,39.52 R35.1 24.85,38.79 U3.37
GPIO26: length 27.2
  Top Layer w0.152: 30.08,33 25.74,37.33 22.99,37.33 19.81,40.51 19.81,52.49 H1.10
GPIO27: length 24.9
  Top Layer w0.152: H1.9 18.53,41.03 22.61,36.95 25.56,36.95 U3.39
GPIO28: length 28.8
  Top Layer w0.152: H1.8 17.27,52.49 17.27,41.52 22.22,36.57 25.37,36.57 U3.40
GPIO29: length 26.5
  Top Layer w0.152: H1.7 15.99,42.04 21.84,36.19 25.19,36.19 U3.41
LINK: length 31.4
  Top Layer w0.152: v1(54.61,5.98) 54.88,5.71 R21.1 ; U4.25 27.18,9.14 v1(33.27,9.14)
  Bottom Layer w0.152: v1(33.27,9.14) 33.27,8.12 33.78,7.61 44.96,7.61 46.48,6.09 54.5,6.09 v1(54.61,5.98)
QSPI_SCLK: length 17
  Top Layer w0.152: U3.52 30.99,27.47 30.99,26.94 29.31,25.27 25.02,25.27 24.13,26.16 23.67,26.16 arc(23.54,26.1) 23.48,25.96 23.48,25.71 arc(23.29,25.52) 23.1,25.71 23.1,25.96 arc(22.91,26.16) 22.72,25.96 22.72,25.71 arc(22.53,25.52) 22.34,25.71 22.34,25.96 arc(22.29,26.1) 22.15,26.16 20.57,26.16 19.81,25.39 19.81,24.88 20.37,24.33
QSPI_SD0: length 17.9
  Top Layer w0.152: U3.53 31.24,27.16 31.24,26.83 29.42,25.01 27.42,25.01 arc(27.29,24.96) 27.23,24.82 27.23,24.44 arc(27.04,24.25) 26.85,24.44 26.85,24.82 arc(26.66,25.01) 26.47,24.82 26.47,24.44 arc(26.28,24.25) 26.09,24.44 26.09,24.82 arc(25.9,25.01) 25.71,24.82 25.71,24.44 arc(25.52,24.25) 25.33,24.44 25.33,24.82 arc(25.14,25.01) 24.95,24.82 24.95,24.44 arc(24.76,24.25) 24.57,24.44 24.57,24.82 arc(24.38,25.01) 24.19,24.82 24.19,24.44 arc(24,24.25) 23.81,24.44 23.81,24.82 arc(23.75,24.96) 23.61,25.01 21.48,25.01 U5.5
QSPI_SD1: length 16.9
  Top Layer w0.152: U3.55 30.86,25.65 30.86,24.25 30.34,23.73 arc(30.21,23.68) 30.08,23.73 29.96,23.85 arc(29.69,23.84) 29.69,23.58 29.81,23.46 arc(29.81,23.19) 29.54,23.19 29.43,23.31 arc(29.16,23.31) 29.16,23.04 29.27,22.93 arc(29.27,22.66) 29,22.66 28.89,22.77 arc(28.62,22.77) 28.62,22.5 28.73,22.39 arc(28.73,22.12) 28.46,22.12 28.35,22.23 arc(28.08,22.23) 28.08,21.96 28.19,21.85 arc(28.19,21.58) 27.92,21.58 27.81,21.69 arc(27.54,21.69) 27.54,21.42 27.65,21.31 arc(27.71,21.17) 27.65,21.04 25.27,18.66 24.24,18.66 U5.2
QSPI_SD2: length 14.8
  Top Layer w0.152: U5.3 25.02,19.68 25.53,19.68 26.54,20.69 26.54,21.78 26.76,22 arc(26.82,22.13) 26.76,22.27 26.5,22.54 arc(26.5,22.8) 26.77,22.81 27.03,22.54 arc(27.3,22.54) 27.3,22.81 27.03,23.07 arc(27.04,23.34) 27.3,23.34 27.57,23.08 arc(27.84,23.07) 27.84,23.34 27.68,23.51 arc(27.68,23.78) 27.95,23.78 28.11,23.61 arc(28.25,23.56) 28.38,23.61 31.5,26.73 31.5,26.85 32.06,27.41
QSPI_SD3: length 16.7
  Top Layer w0.152: U5.7 18.92,23.97 18.92,25.01 20.45,26.54 24.26,26.54 25.27,25.52 29.21,25.52 30.64,26.95 30.64,27.69 U3.51
QSPI_SS_N: length 18.5
  Top Layer w0.152: U3.56 31.37,25.59 31.37,23.87 27.78,20.28 arc(27.72,20.14) 27.78,20.01 27.96,19.82 arc(27.96,19.55) 27.69,19.55 27.51,19.74 arc(27.24,19.74) 27.24,19.47 27.42,19.28 arc(27.42,19.01) 27.16,19.01 26.97,19.2 arc(26.7,19.2) 26.7,18.93 26.89,18.74 arc(26.89,18.47) 26.62,18.47 26.43,18.66 arc(26.29,18.72) 26.16,18.66 24.34,16.84 24.26,16.84 ; 24.26,16.84 24.24,16.84 ; 24.26,16.84 U5.1
RCT: length 14.1
  Top Layer w0.127: R30.2 41.63,15.84 v1(42.16,16.38) 42.42,16.63 C6.2
  Top Layer w0.178: R29.2 41.4,18.71 v1(41.4,19.17)
  Inner2 w0.254: v1(41.4,19.17) 42.16,18.41 v1(42.16,16.38) 46.48,16.38 46.86,16.76 50.23,16.76 J1.5
RUN: length 19.3
  Top Layer w0.152: H1.19 36.69,45.77 R39.1
  Top Layer w0.203: 34.53,34.98 36.84,37.29 36.84,39.34
RXN: length 6.2
  Top Layer w0.127: R33.1 39.12,16.38 39.12,16.8 39.38,17.06 40.92,17.06 R30.1 41.63,17.06 41.83,17.06 43.05,18.28 C7.1
RXP: length 6.3
  Top Layer w0.127: C8.1 42.79,18.45 41.71,17.37 41.63,17.37 R29.1 40.92,17.37 39.26,17.37 38.9,17.01 38.48,17.01 R34.2
SWCLK: length 20.7
  Top Layer w0.152: H1.27 42.42,50.2 42.42,41.21 38.8,37.58 38.1,37.58 35.81,35.3 35.81,35.13 U3.24
SWDIO: length 19.1
  Top Layer w0.152: 34.81,34.69 39.88,39.76 39.88,50.2 H1.25
TXN: length 27.3
  Top Layer w0.127: J1.2 48.79,12.93 48.84,12.97 48.84,13.15 49.05,13.36 49.34,13.36 49.6,13.1 51.17,13.1 51.84,12.43 51.84,10.67 51.3,10.13 49.4,10.13 arc(49.04,10.28) 48.9,10.64 48.9,10.72 arc(48.67,10.95) 48.44,10.72 48.44,9.76 arc(47.93,9.25) 47.42,9.76 47.42,10.78 arc(47.19,11) 46.97,10.78 46.97,9.76 arc(46.46,9.25) 45.95,9.76 45.95,9.9 arc(45.88,10.06) 45.72,10.13 45.48,10.13 42.35,13.26 41.66,13.26 R26.1 40.9,13.25 ; 40.88,13.24 39.68,13.24 39.37,13.55 39.3,13.55 39.24,13.5 39.24,13.08 38.91,12.75
TXP: length 27.5
  Top Layer w0.127: 40.87,13.54 39.81,13.54 39.5,13.85 39.17,13.85 39.03,13.71 38.61,13.71 R32.2 ; J1.1 49.16,11.66 49.12,11.7 49.12,13.04 49.16,13.08 49.23,13.08 49.49,12.82 51.05,12.82 51.56,12.31 51.56,10.79 51.18,10.41 49.4,10.41 arc(49.24,10.47) 49.17,10.64 49.17,10.72 arc(48.67,11.23) 48.16,10.72 48.16,9.76 arc(47.93,9.53) 47.7,9.76 47.7,10.78 arc(47.19,11.28) 46.69,10.78 46.69,9.76 arc(46.46,9.53) 46.23,9.76 46.23,9.9 arc(46.08,10.26) 45.72,10.41 45.59,10.41 42.46,13.54 41.65,13.54 41.28,13.91 40.9,13.53
USB+: length 18.4
  Top Layer w0.152: R2.2 14.73,30.68 22.48,30.68 26.04,27.12 27.56,27.12 29.12,28.68 29.3,28.68 29.58,28.96 29.64,28.96 30.08,29.39
USB-: length 18.1
  Top Layer w0.152: U3.46 29.36,29.24 29.36,29.17 29.17,28.99 28.99,28.99 27.43,27.42 26.16,27.42 22.61,30.98 14.73,30.98 R1.2
XIN: length 7.7
  Top Layer w0.152: U3.20 36.85,33.9 39.5,33.9 40,34.41 40.96,34.41 X1.1 41.94,32.63 C31.2
XOUT: length 6.4
  Top Layer w0.152: C32.2 40.6,35.49 X1.3 39.27,34.16 36.54,34.16 35.95,33.56
$1N272: length 18.8
  Top Layer w0.711: 53.55,23.85 54.53,23.85 56.2,25.52
  Inner2 w0.762: 53.55,23.85 J1.SH1
$1N523: length 1.6
  Top Layer w0.254: R3.2 9.07,32.48 USB1.4
$1N532: length 1.7
  Top Layer w0.254: R8.2 8.99,29.48 USB1.10
$1N2010: length 1.6
  Top Layer w0.254: 12.54,22.79 11.25,22.79 R9.1
$1N3119: length 1.8
  Top Layer w0.254: LED3.2 24.71,40.39 R35.2
$1N3535: length 25.3
  Top Layer w0.203: R41.2 23.13,15.82 13.51,15.82 5.39,23.94 SW1.1
$1N4654: length 3
  Top Layer w0.203: R39.2 35.19,40.58 RUN.1
$1N8144: length 1.5
  Top Layer w0.254: U2.10 12.91,6.13 C5.1
$1N8171: length 1.1
  Top Layer w0.178: LED2.3 17.87,7.1 R11.1
$1N8173: length 5.4
  Top Layer w0.152: U2.9 12.41,6.18 12.31,6.09 12.31,4.76 arc(12.37,4.6) 12.53,4.54 arc(12.68,4.47) 12.75,4.32 12.75,4.12 arc(12.68,3.97) 12.53,3.9 arc(12.37,3.84) 12.31,3.68 12.31,3.53 12.72,3.13 12.79,3.13 13.02,3.35 R15.1
$1N8174: length 5.4
  Top Layer w0.152: R16.1 13.02,2.59 12.79,2.82 12.59,2.82 12,3.41 12,6.09 11.91,6.18 U2.8
$1N8175: length 3.7
  Top Layer w0.254: R14.2 16.7,2.59 17.14,3.03 LED2.4
$1N8176: length 2.4
  Top Layer w0.254: LED2.1 16.34,3.41 R13.2
$1N8597: length 1.5
  Top Layer w0.254: USB2.4 8.56,14.07 R12.2
$1N8606: length 1.5
  Top Layer w0.254: USB2.10 8.53,11.07 R17.2
$1N16354: length 18.1
  Top Layer w0.127: C7.2 44.33,19.63 44.95,20.25 44.95,20.27 46.41,21.73 49.51,21.73 51.56,19.68 51.56,16.5 50.67,15.61 49.91,15.61 47.71,17.82 J1.6
$1N16357: length 18.2
  Top Layer w0.127: C8.2 44.07,19.81 44.73,20.47 44.75,20.47 46.29,22.01 49.63,22.01 51.84,19.79 51.84,16.39 50.79,15.33 49.8,15.33 49.58,15.55 49.47,15.55 49.34,15.42 49.34,15.3 50.25,14.39 J1.3
$1N16389: length 9.2
  Top Layer w0.203: 56.57,5.71 56.85,5.71 59.82,8.67 59.82,11.55 60.29,12.02 J1.10
$1N16464: length 15.6
  Top Layer w0.203: J1.11 61.5,14.25 59.06,11.8 59.06,8.88 57.1,6.93 56.55,6.93
$1N16754: length 5.2
  Top Layer w0.152: J1.4 44.14,15.47 R19.2 43.99,14.33 C10.2
$1N16860: length 1.7
  Top Layer w0.203: 34.55,14.94 34.4,14.94 U4.10
$1N16990: length 1.9
  Top Layer w0.203: C34.2 26.63,13.39 U4.20
$1N16993: length 2.3
  Top Layer w0.203: 25.28,12.08 25.43,11.93 26.68,11.93 27.27,11.34
$1N21081: length 1.1
  Top Layer w0.152: U2.6 9.87,7.07 R18.2
$1N41377: length 2.8
  Top Layer w0.254: LED1.2 11.39,28.06 R4.1
$1N41485: length 5.5
  Top Layer w0.152: 24.56,32.05 25.37,31.24 C29.2 25.65,31.36 26.8,31.36 28.07,30.09 28.52,30.09 U3.43
$1N55884: length 8.7
  Top Layer w0.152: X2.1 22.11,5.82 22.99,4.94 C35.2 23.94,4.87 R37.1 26.07,5.34 26.92,5.34 U4.30
$1N55913: length 4.7
  Top Layer w0.152: R38.2 26.03,4.26 26.24,4.26 26.8,4.82 27.11,4.82 U4.31
$1N55914: length 3
  Top Layer w0.152: R38.1 23.38,3.42 C33.2 22.09,4.71 21.82,4.71
$1N70865: length 4.9
  Top Layer w0.127: 35.04,12.05 35.5,12.51 35.5,12.65 35.64,12.79 35.64,13.03 36.32,13.71 36.32,14 37.43,15.11 37.84,15.11 38.18,15.44
$1N70868: length 4.9
  Top Layer w0.127: R34.1 37.21,15.74 37.21,15.32 36.02,14.13 36.02,13.83 35.34,13.16 35.34,12.92 35.29,12.86 35.15,12.86 U4.6
$1N70953: length 2.5
  Top Layer w0.152: R31.2 38.23,12.06 37.74,12.06 36.92,11.23 36.92,11.09 36.46,10.64
$1N70956: length 2.5
  Top Layer w0.152: 37.67,12.77 37.67,12.41 36.7,11.45 36.56,11.45 U4.2

## Copper pours and planes (outline as drawn; the poured copper is in the pictures)
1V1 on Inner2: 31.93,33.7 33.45,33.7 35.43,35.68 36.96,35.68 37.2,35.44 37.2,34.68 35.21,32.69 34.51,32.69 34.2,32.38 32.89,32.38 30.04,29.52 30.04,28.78 30.82,28 30.82,26.83 30.25,26.27 29.58,26.27 29.14,26.71 29.96,27.53 29.96,28.09 29.24,28.82 28.7,28.82 28.24,28.36 28.24,28.35 27.94,28.35 27.26,29.03
3V3 on Top Layer: 14.22,26.85 15.88,26.85 15.88,23.36 14.22,23.36
3V3 on Top Layer: 33.96,8.12 36.45,8.12 36.45,5.71 33.96,5.71
3V3 on Inner2: 14.34,25.13 19.51,25.13 32.25,37.86 32.25,54.46 33.02,55.24 37.47,55.24 38.1,54.6 38.1,39.32 43.04,34.38 49.79,34.38 50.67,33.5 50.67,32.14 49.89,31.36 41.15,31.36 39.24,29.46 39.24,27.81 34.15,22.72 34.15,9.52 36.85,6.82 36.85,5.35 33.27,1.77 22.78,1.77 20.67,4.44 10.54,4.44 9.65,5.33 9.65,9.32 10.41,10.08 15.67,10.08 15.67,20.71 14.34,22.04
3V3A on Inner2: 27.62,13.39 24.64,10.41 22.1,10.41 21.46,11.04 21.46,11.36 21.87,11.76 23.43,11.76 28.06,16.39 34.12,16.39 37.47,13.05 37.47,13.07 38.74,11.8 40,11.8 41.03,12.82 41.03,15.28 42.05,16.3 42.74,16.3 43.43,15.61 42.29,14.48 42.29,11.17 41.66,10.53 37.57,10.53 36.68,11.42 36.23,11.42 34.26,13.39
+5V on Top Layer: 8.89,26.66 13.34,26.66 13.34,24 8.89,24
GND on Top Layer: 12.06,27.42 14.35,27.42 14.35,25.58 12.06,25.58
GND on Top Layer: 0.44,57.97 63.94,57.97 67.88,54.03 67.88,1.33 64.45,-2.1 2.48,-2.1 -2.1,2.47 -2.1,55.43
GND on Bottom Layer: 0.13,57.52 64.13,57.52 68.2,53.46 68.2,3.55 63.12,-1.53 0.89,-1.53 -3.43,2.79 -3.43,53.97
GND on Inner1: -0.89,58.29 62.61,58.29 66.55,54.35 66.55,1.64 63.12,-1.78 1.14,-1.78 -3.43,2.79 -3.43,55.75
GND on Inner2: -0.25,56.64 63.75,56.64 68.96,51.43 68.96,4.06 62.99,-1.91 1.4,-1.91 -2.92,2.41 -2.92,53.97

Small or netless copper shapes (teardrops, artwork), in the pictures only: 376 on Top Layer, 30 on Bottom Layer, 3 on Inner1, 18 on Inner2

## Text on the board
Bottom Silkscreen Layer: Amanitaphalloides / Copyright © 2025
Top Silkscreen Layer: VBUS | GND | VREF | 28 | 29 | 26 | 27 | 24 | 25 | 22 | 23 | RUN | 3V3 | SWD | SWC | 15 | 14 | 9 | 8 | 7 | 6 | 5 | 4 | 3 | 2 | IO25 | W5500 | QOpen / RP-W5500 | FLASH | V2.0 | UART | USB | BOOT
